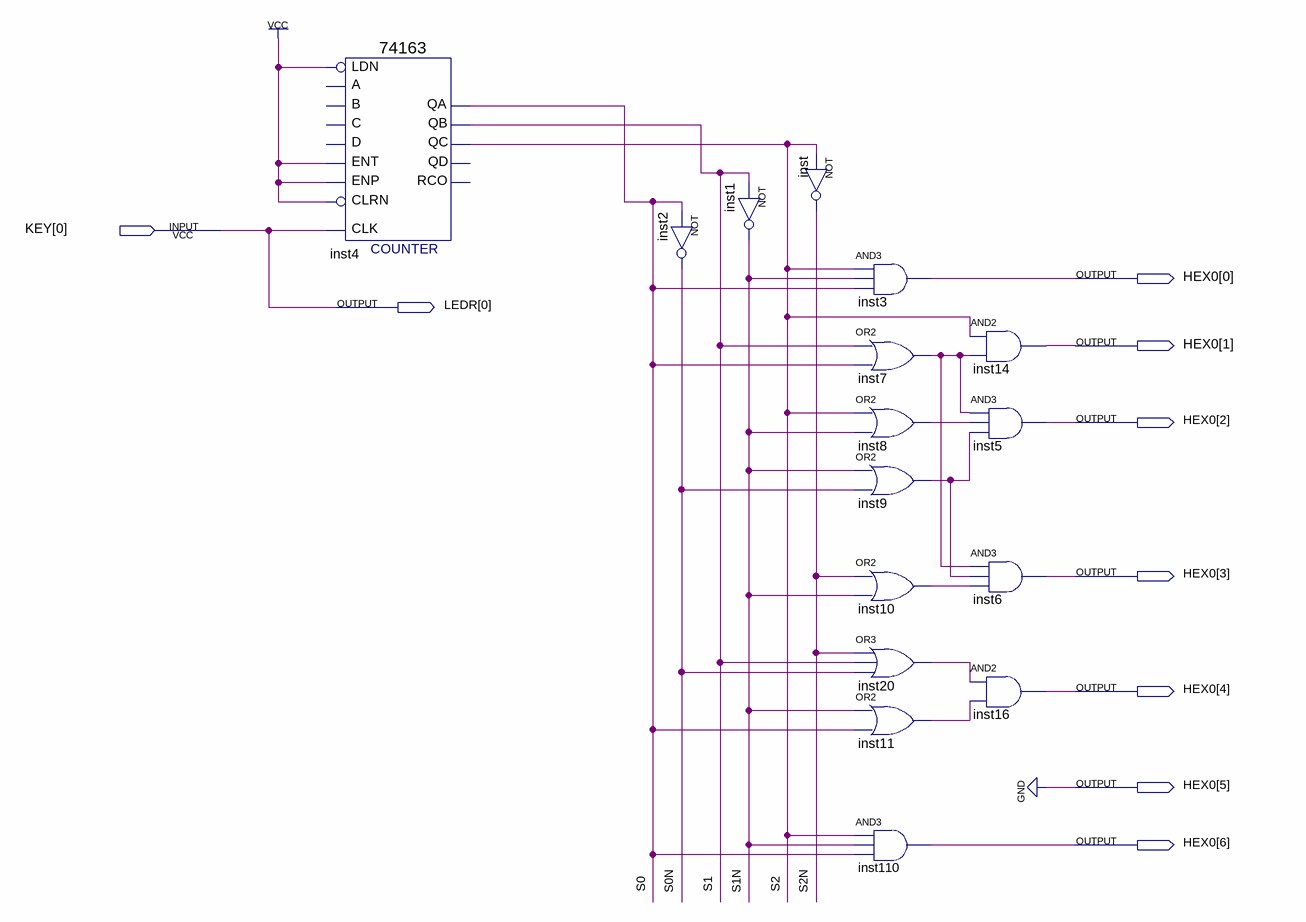
[diagram p0: schematic sheet]
// Quartus schematic pos_clk.bdf as structural Verilog: 16 symbols, 9 pins
module pos_clk (
  input  [0:0] KEY,
  output [6:0] HEX0,
  output [0:0] LEDR
);

  wire inst7_out, inst8_out, inst9_out, inst10_out, inst11_out, inst20_out, S0, S0N, S1, S1N, S2, S2N;

  \74163  inst4 (
    .ENT(1'b1), .CLRN(1'b1), .CLK(KEY[0]), .ENP(1'b1), .LDN(1'b1), .QA(S0), .QB(S1), .QC(S2));  // open: C, B, A, D, QD, RCO
  not inst1 (S1N, S1);
  not inst2 (S0N, S0);
  not inst (S2N, S2);
  and inst3 (HEX0[0], S2, S1N, S0);
  or inst7 (inst7_out, S1, S0);
  or inst8 (inst8_out, S2, S1N);
  or inst9 (inst9_out, S1N, S0N);
  or inst10 (inst10_out, S2N, S1N);
  or inst20 (inst20_out, S2N, S1, S0N);
  or inst11 (inst11_out, S1N, S0);
  and inst110 (HEX0[6], S2, S1N, S0);
  and inst14 (HEX0[1], S2, inst7_out);
  and inst5 (HEX0[2], inst7_out, inst8_out, inst9_out);
  and inst6 (HEX0[3], inst7_out, inst9_out, inst10_out);
  and inst16 (HEX0[4], inst20_out, inst11_out);

  assign HEX0[5] = 1'b0;
  assign LEDR[0] = KEY[0];
endmodule
